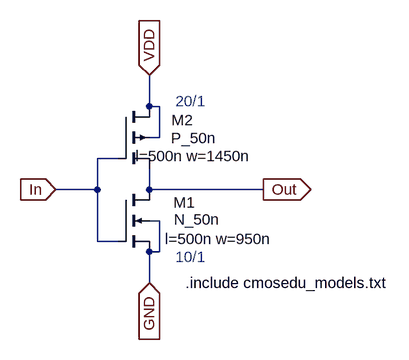
[diagram p0: schematic INV_20_10.asc]
INV_20_10.asc, the LTspice schematic file:
Version 4
SHEET 1 1136 680
WIRE 448 -304 448 -352
WIRE 464 -304 448 -304
WIRE 464 -256 464 -304
WIRE 464 -256 448 -256
WIRE 400 -224 368 -224
WIRE 368 -176 368 -224
WIRE 368 -176 304 -176
WIRE 448 -176 448 -208
WIRE 624 -176 448 -176
WIRE 464 -128 448 -128
WIRE 368 -96 368 -176
WIRE 400 -96 368 -96
WIRE 464 -80 464 -128
WIRE 464 -80 448 -80
WIRE 448 -32 448 -80
FLAG 304 -176 In
IOPIN 304 -176 In
FLAG 448 -352 VDD
IOPIN 448 -352 In
FLAG 448 -32 GND
IOPIN 448 -32 In
FLAG 624 -176 Out
IOPIN 624 -176 Out
SYMBOL nmos4 400 -176 R0
WINDOW 0 119 20 Right 2
WINDOW 3 157 46 Right 2
WINDOW 123 238 76 Right 2
SYMATTR InstName M1
SYMATTR Value N_50n
SYMATTR Value2 l=500n w=950n
SYMBOL pmos4 400 -304 R0
WINDOW 0 116 21 Right 2
WINDOW 3 151 49 Right 2
WINDOW 123 206 76 Right 2
SYMATTR InstName M2
SYMATTR Value P_50n
SYMATTR Value2 l=500n w=1450n
TEXT 488 -312 Left 2 ;20/1
TEXT 488 -72 Left 2 ;10/1
TEXT 504 -32 Left 2 !.include cmosedu_models.txt

The netlist it stands for:
* INV_20_10.asc
M1 Out In GND GND N_50n l=500n w=950n
M2 VDD In Out VDD P_50n l=500n w=1450n
.model NMOS NMOS
.model PMOS PMOS
.lib standard.mos
* 20/1
* 10/1
.include cmosedu_models.txt
.backanno
.end